# Altium schematic sheet DAC.SchDoc
size 406 x 304 mm; SheetNumber: 7; SheetTotal: 14
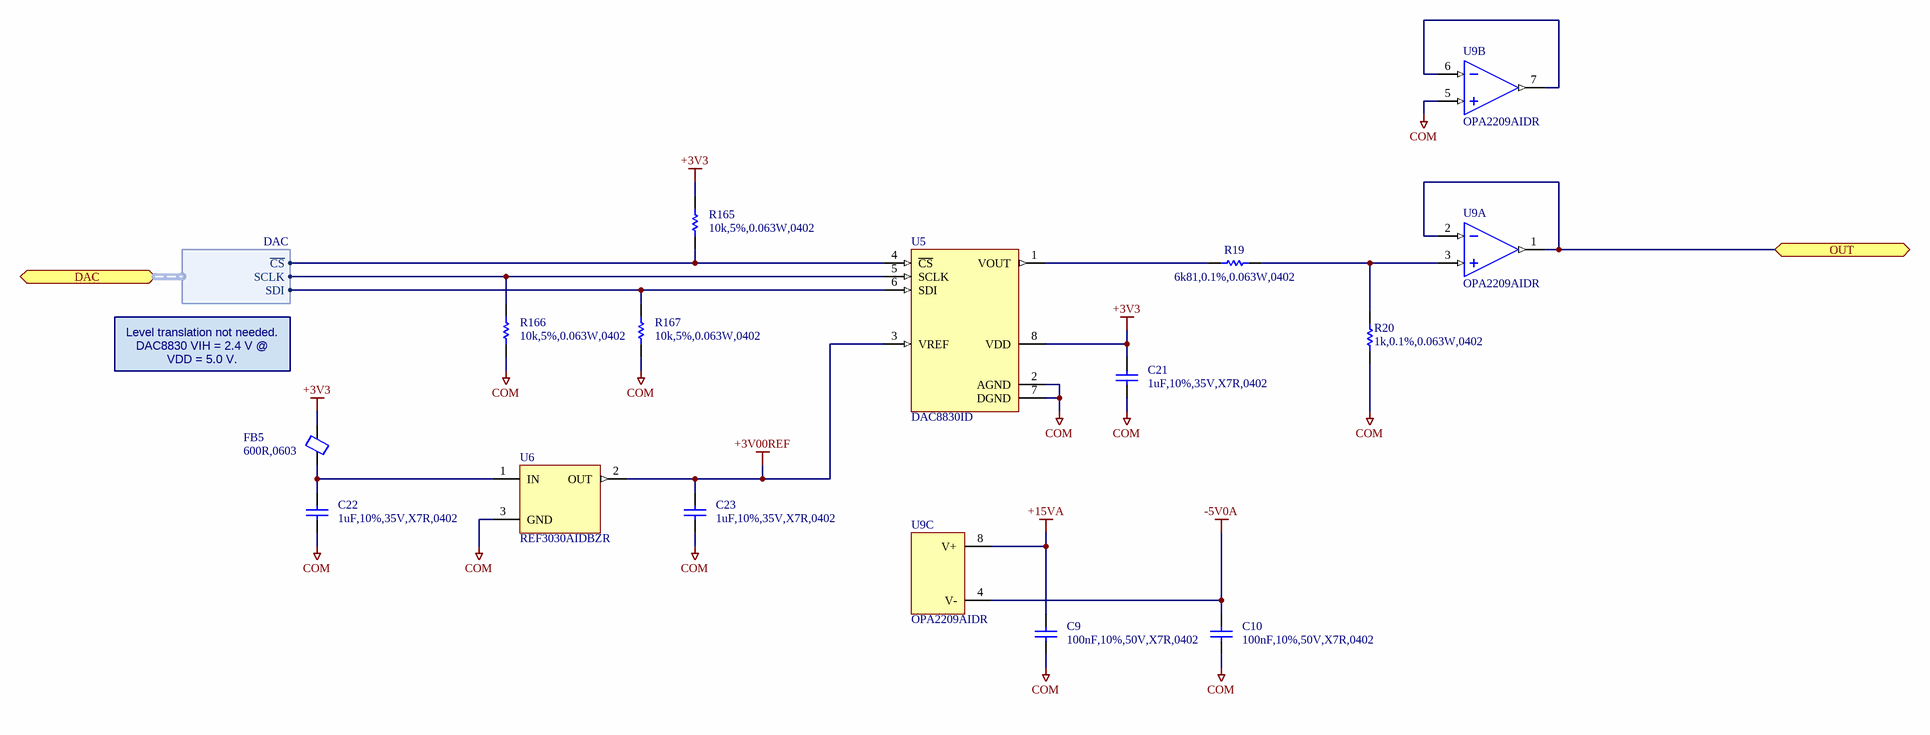
[diagram p0: DAC.SchDoc]

## Parts
C9  100nF,10%,50V,X7R,0402  [CAPC1005X06N]
C10  100nF,10%,50V,X7R,0402  [CAPC1005X06N]
C21  1uF,10%,35V,X7R,0402  [CAPC1005X06N]
C22  1uF,10%,35V,X7R,0402  [CAPC1005X06N]
C23  1uF,10%,35V,X7R,0402  [CAPC1005X06N]
FB5  600R,0603  [INDC_0603]
R19  6k81,0.1%,0.063W,0402  [RESC1005X04N]
R20  1k,0.1%,0.063W,0402  [RESC1005X04N]
R165  10k,5%,0.063W,0402  [RESC1005X04N]
R166  10k,5%,0.063W,0402  [RESC1005X04N]
R167  10k,5%,0.063W,0402  [RESC1005X04N]
U5  DAC8830ID  [TEXASINSTRUMENTS_PKG_D0008A]
U6  REF3030AIDBZR  [SOT95P237X112-3N]
U9  OPA2209AIDR  [TEXASINSTRUMENTS_PKG_D0008A]  (parts A,B,C of 3)

## Ports
DAC (bidir, harness DAC), OUT (bidir)

## Harnesses
DAC: SDI, SCLK, ~{CS}

## Nets
+3V00REF: C23.2 U5.3(VREF) U6.2(OUT)
+3V3: C21.2 FB5.2 R165.1 U5.8(VDD)
+15VA: C9.2 U9.8(V+)
-5V0A: C10.2 U9.4(V-)
COM: C9.1 C10.1 C21.1 C22.1 C23.1 R20.1 R166.2 R167.2 U5.2(AGND) U5.7(DGND) U6.3(GND) U9.5(+INB)
OUT: U9.1(OUTA) U9.2(-INA) ; port OUT
NetC22_2: C22.2 FB5.1 U6.1(IN)
NetR19_1: R19.1 U5.1(VOUT)
NetR19_2: R19.2 R20.2 U9.3(+INA)
NetR165_2: R165.2 U5.4(~{CS}) ; port DAC.~{CS}
NetR166_1: R166.1 U5.5(SCLK) ; port DAC.SCLK
NetR167_1: R167.1 U5.6(SDI) ; port DAC.SDI
NetU9_6: U9.6(-INB) U9.7(OUTB)

## Notes on the sheet
- Level translation not needed.
  DAC8830 VIH = 2.4 V @
  VDD = 5.0 V.
- Rev
- Sheet Name:
- Date:
- Sheet
- Designer:
- of

## Library data of the parts
C9 C10 = CAP,Cer,100nF,10%,50V,X7R,0402: 50V 100nF X7R Â±10% 0402 Ceramic Capacitors ROHS; Manufacturer 1: Murata; Manufacturer 1 Part Number: GRM155R71H104KE14D; Vendor 1 Part Number: C77020; Vendor 1: LCSC; Value: 100n; Part Name: CAP,Cer,100nF,10%,50V,X7R,0402; CreatedBy: Judd Foster; HelpURL: https://www.lcsc.com/datasheet/C77020.pdf
C21-C23 = CAP,Cer,1uF,35VDC,X5R,0402: 1 ï¿½F ï¿½10% 35V Ceramic Capacitor X5R 0402 (1005 Metric); Manufacturer 1: TDK Corporation; Manufacturer 1 Part Number: C1005X5R1V105K050BC; Vendor 1 Part Number: 445-9073-1-ND; Vendor 1: Digikey; Value: 1u; Part Name: CAP,Cer,1uF,35VDC,X5R,0402; CreatedBy: Judd Foster; HelpURL: https://product.tdk.com/info/en/catalog/datasheets/mlcc_commercial_general_en.pdf?ref_disty=digikey
FB5 = FERRITE,600R@100MHz,350mA,0603: 500mÎ© Â±25% 600Î©@100MHz 0603 Ferrite Beads and Chips ROHS; Manufacturer 1: TAI-TECH; Manufacturer 1 Part Number: FCM1608KF-601T03; Vendor 1 Part Number: C141723; Vendor 1: LCSC; Part Name: FERRITE,600R@100MHz,350mA,0603; CreatedBy: Judd Foster; HelpURL: https://www.lcsc.com/datasheet/C141723.pdf
R19 = RES,6k81,0.1%,0.063W,0402: 6.81kÎ© 62.5mW 50V Â±25ppm/â„ƒ Thin Film Resistor Â±0.1% 0402 Chip Resistor - Surface Mount RoHS; Manufacturer 1: YAGEO; Manufacturer 1 Part Number: AT0402BRD076K81L; Vendor 1 Part Number: C851098; Vendor 1: LCSC; Part Name: RES,6k81,0.1%,0.063W,0402; CreatedBy: Judd Foster; HelpURL: https://www.lcsc.com/datasheet/C851098.pdf; Value: 6k81
R20 = RES,1k,0.1%,0.063W,0402: 1 kOhms Â±0.1% 0.063W, 1/16W Chip Resistor 0402 (1005 Metric) Thin Film; Manufacturer 1: YAGEO; Manufacturer 1 Part Number: RT0402BRE071KL; Vendor 1 Part Number: YAG2306CT-ND; Vendor 1: DigiKey; Part Name: RES,1k,0.1%,0.063W,0402; CreatedBy: Judd Foster; HelpURL: https://www.yageo.com/upload/media/product/app/datasheet/rchip/pyu-rt_1-to-0.01_rohs_l.pdf; Value: 1k
R165-R167 = RES,10k,5%,0.063W,0402: 10 kOhms ï¿½5% 0.063W, 1/16W Chip Resistor 0402 (1005 Metric) Automotive AEC-Q200 Thick Film; Manufacturer 1: Stackpole Electronics Inc; Manufacturer 1 Part Number: RMCF0402JT10K0; Vendor 1 Part Number: RMCF0402JT10K0CT-ND; Vendor 1: DIgikey; Part Name: RES,10k,5%,0.063W,0402; CreatedBy: Judd Foster; HelpURL: https://www.seielect.com/catalog/sei-rmcf_rmcp.pdf; Value: 10k
U5 = DAC8830ID: 16 Bit Digital to Analog Converter 1 8-SOIC; Manufacturer 1: Texas Instruments; Vendor 1 Part Number: 296-21738-5-ND; Vendor 1: DigiKey; Part Name: DAC8830ID; CreatedBy: Judd Foster; HelpURL: https://www.ti.com/lit/ds/symlink/dac8830.pdf?HQS=dis-dk-null-digikeymode-dsf-pf-null-wwe&ts=1758462298577&ref_url=https%253A%252F%252Fwww.ti.com%252Fgeneral%252Fdocs%252Fsuppproductinfo.tsp%253FdistId%253D10%2526gotoUrl%253Dhttps%253A%252F%252Fwww.ti.com; Manufacturer 1 Part Number: DAC8830ID
U6 = REF3030AIDBZR: 3V ï¿½0.2% 3.05V~5.5V 25mA Fixed SOT-23 Voltage References ROHS; Manufacturer 1: Texas Instruments; Vendor 1 Part Number: C38423; Vendor 1: LCSC; Part Name: REF3030AIDBZR; CreatedBy: Judd Foster; HelpURL: https://www.ti.com/lit/ds/symlink/ref3030.pdf?ts=1702271215532&ref_url=https%253A%252F%252Fwww.ti.com%252Fproduct%252FREF3030%252Fpart-details%252FREF3030AIDBZR; Manufacturer 1 Part Number: REF3030AIDBZR
U9 = OPA2209AIDR: 35uV 18MHz 4.5nA 6.4V/us 130dB SOIC-8 Amplifiers ROHS; Manufacturer 1: Texas Instruments; Vendor 1 Part Number: C2057330; Vendor 1: LCSC; Part Name: OPA2209AIDR; CreatedBy: Judd Foster; HelpURL: https://www.lcsc.com/datasheet/C2057330.pdf; Manufacturer 1 Part Number: OPA2209AIDR